# Altium schematic sheet Sensors.SchDoc: Sensors
size A3; SheetNumber: 4; SheetTotal: 5
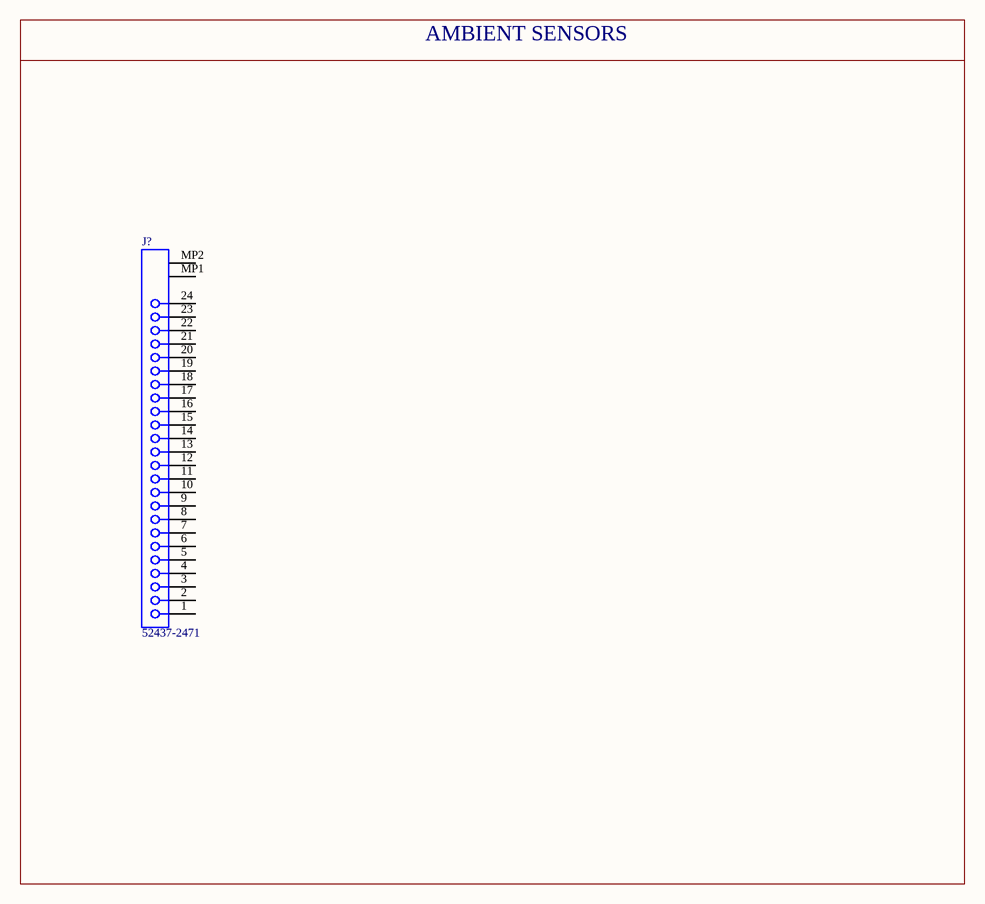
[diagram p0: Sensors.SchDoc]

## Parts
J?  52437-2471  [MOLX-52437-2471]

## Blocks framed on the sheet
AMBIENT SENSORS: J?

## Nets

Not connected (* = marked no-connect by the designer): J? 1 2 3 4 5 6 7 8 9 10 11 12 13 14 15 16 17 18 19 20 21 22 23 24 MP1 MP2

## Notes on the sheet
- Title
- Size:
- Date:
- A3
- Author:
- Time:
- Revision:
- Sheet
- of
- File:

## Library data of the parts
J? = CMP-1241-00285-1: 0.5 mm Pitch Easy-On(TM) Type FPC Connector, Right Angle, ZIF, SMT, Bottom Contact, 24 Circuits, -40 to 85 degC, ELV and RoHS Compliant, Tape and Reel; Manufacturer: Molex; Material - Metal: Phosphor Bronze; Material - Plating Mating: Gold; Durability (mating cycles max): 20; Stackable: No; Entry Angle: 90degrees Angle; Circuits (Loaded): 24; Current (Max per Contact): 0.5A; PCB Retention: None; Pitch - Mating Interface: 0.50mm; Polarized to PCB: Yes; Voltage (Max): 50V; ComponentLink2URL: http://www.molex.com/webdocs/datasheets/pdf/en-us/0524372471_FFC_FPC_CONNECTORS.pdf; ComponentLink1URL: http://www.molex.com/molex/index.jsp; Mounting Technology: Surface Mount; RoHS: TRUE; PartNumber: 52437-2471; ComponentLink3Description: Package Specification; ComponentLink2Description: Datasheet; PackageReference: 52437-2471; Contact Position: Bottom; ComponentLink3URL: http://www.molex.com/pdm_docs/sd/524372471_sd.pdf; ComponentLink1Description: Manufacturer URL; PackageVersion: Rev. E, 07/2013; Number of Rows: 1; PCB Locator: No; Packing: Tape and Reel; PackageDescription: 24-Lead FPC Connector, Pitch 0.5 mm; Material - Plating Termination: Gold; Orientation: Right Angle